# Altium schematic sheet Sheet1.SchDoc
size 431 x 279 mm; SheetNumber: 1; SheetTotal: 1; ENG_APP_DATE: --/--/--; DSN_APP_DATE: --/--/--; CHK_APP_DATE: --/--/--; SPICEModelCacheCJHNTGTK: <root> / <DocumentId>CJHNTGTK</DocumentId> / </root>
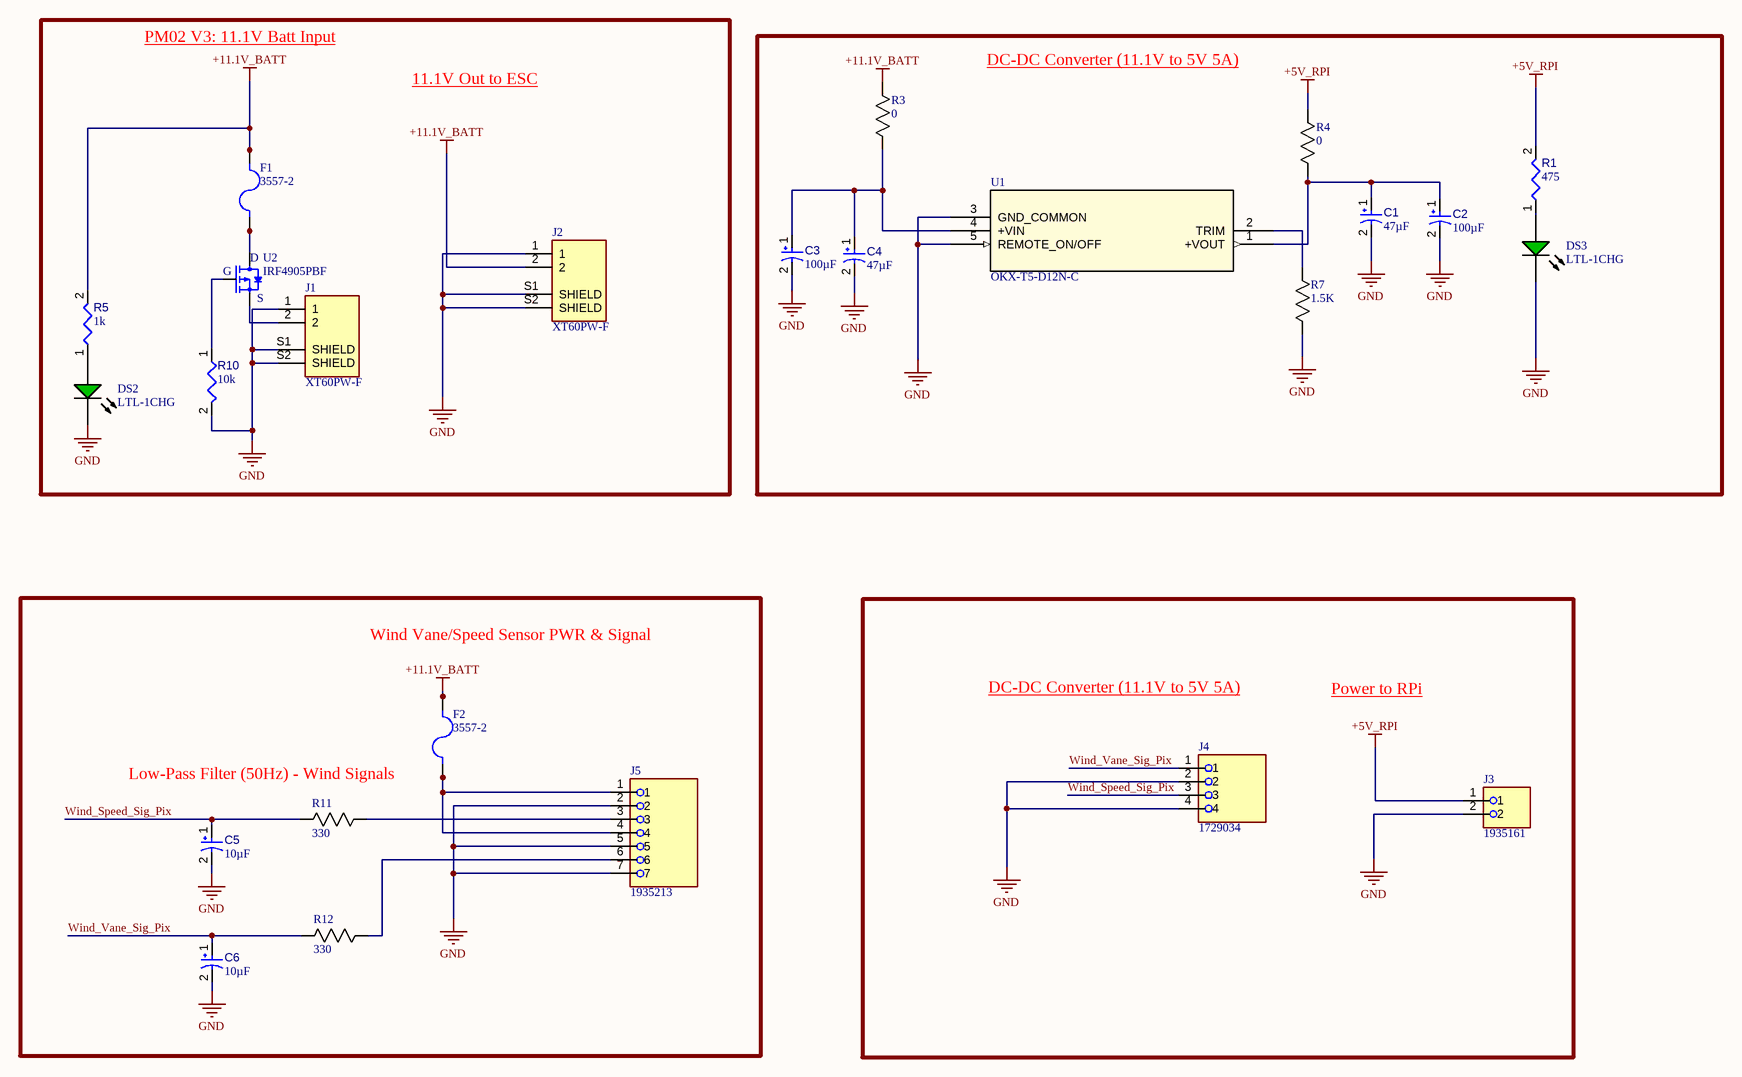
[diagram p0: Sheet1.SchDoc]

## Parts
C1  value 47µF  [CAPPR55-250-1120X630X1220]  (hidden comment: ECA-1HM470)
C2  value 100µF  [CAPPR65-350-1150X800X1250]  (hidden comment: ECA1HM101)
C3  value 100µF  [CAPPR65-350-1150X800X1250]  (hidden comment: ECA1HM101)
C4  value 47µF  [CAPPR55-250-1120X630X1220]  (hidden comment: ECA-1HM470)
C5  value 10µF  [CAPPR55-200-1100X500X1200]  (hidden comment: ECA1HM100)
C6  value 10µF  [CAPPR55-200-1100X500X1200]  (hidden comment: ECA1HM100)
DS2  LTL-1CHG  [LTST-LTL-1CHG-2]
DS3  LTL-1CHG  [LTST-LTL-1CHG-2]
F1  3557-2  [FUSE_3557-2]
F2  3557-2  [FUSE_3557-2]
J1  XT60PW-F  [AMASS_XT60PW-F]
J2  XT60PW-F  [AMASS_XT60PW-F]
J3  1935161  [PHOENIX_1935161]
J4  1729034  [PHOENIX_1729034]
J5  1935213  [PHOENIX_1935213]
R1  value 475  [RESA60-630X240]  (hidden comment: MFR-25FBF52-475R)
R3  value 0  [RES_ZOR25_6P3X2P3_YAG]  (hidden comment: RES 0 OHM JUMPER 1/4W AXIAL)
R4  value 0  [RES_ZOR25_6P3X2P3_YAG]  (hidden comment: RES 0 OHM JUMPER 1/4W AXIAL)
R5  value 1k  [RESA60-630X240]  (hidden comment: MFR-25FBF52-1K)
R7  1.5K  [STA_CF14_STP]
R10  value 10k  [RESA60-630X240]  (hidden comment: MFR-25FBF52-10K)
R11  value 330  [STA_CF14_STP]  (hidden comment: CF14JT330R)
R12  value 330  [STA_CF14_STP]  (hidden comment: CF14JT330R)
U1  OKX-T5-D12N-C  [OKX-T5-D12N-C_MUR]
U2  IRF4905PBF  [PG-TO220-3_INF]

## Blocks framed on the sheet
DC-DC Converter (11.1V to 5V 5A): C1-C4 DS3 R1 R3 R4 R7 U1

## Nets
+5V_RPI: J3.1 R1.2 R4.2
+11.1V_BATT: F1.2_1 F1.2_2 F2.2_1 F2.2_2 J2.2 R3.2 R5.2
GND: C1.2 C2.2 C3.2 C4.2 C5.2 C6.2 DS2.2(K) DS3.2(K) J1.1 J1.S1(SHIELD) J1.S2(SHIELD) J2.1 J2.S1(SHIELD) J2.S2(SHIELD) J3.2 J4.2 J4.4 J5.2 J5.5 J5.7 R7.1 R10.2 U1.3(GND_COMMON) U1.5(REMOTE_ON/OFF)
Wind_Speed_Sig_Pix: C5.1 J4.3 R11.1
Wind_Vane_Sig_Pix: C6.1 J4.1 R12.1
NetC1_1: C1.1 C2.1 R4.1 U1.1(+VOUT)
NetC3_1: C3.1 C4.1 R3.1 U1.4(+VIN)
NetDS2_1: DS2.1(A) R5.1
NetDS3_1: DS3.1(A) R1.1
NetF1_1_1: F1.1_1 F1.1_2 U2.2(D)
NetF2_1_1: F2.1_1 F2.1_2 J5.1 J5.4
NetJ1_2: J1.2 U2.3(S)
NetJ5_3: J5.3 R11.2
NetJ5_6: J5.6 R12.2
NetR7_2: R7.2 U1.2(TRIM)
NetR10_1: R10.1 U2.1(G)

## Notes on the sheet
- PM02 V3: 11.1V Batt Input <https://www.murata.com/products/productdata/8807038779422/okx-t5-d12.pdf>
- 11.1V Out to ESC <https://www.murata.com/products/productdata/8807038779422/okx-t5-d12.pdf>
- Wind Vane/Speed Sensor PWR & Signal
- DC-DC Converter (11.1V to 5V 5A) <https://www.murata.com/products/productdata/8807038779422/okx-t5-d12.pdf>
- Power to RPi <https://www.murata.com/products/productdata/8807038779422/okx-t5-d12.pdf>
- (near F2) Low-Pass Filter (50Hz) - Wind Signals
- DWG. NO.
- REV.
- SHT.
- THIS DOCUMENT AND THE DATA DISCLOSED HEREIN OR HEREWITH IS THE PROPERTY OF ALTIUM LIMITED AND MAY BE FREELY DISTRIBUTED IN WHOLE. NO RIGHTS ARE RESERVED OR EXPRESS OR IMPLIED WARANTEE GIVEN.
- REVISION
- DESCRIPTION
- DATE
- APPROVED
- ENG:
- APPROVALS
- PROJECT
- DSN:
- CHK:
- REFERENCE DOCUMENTS
- PROJECT REVISION:
- TITLE
- DOCUMENT REVISION:
- DESIGN ITEM:
- BOM:
- FAB DWG:
- PCB DWG:
- ASSY DWG:
- SCALE:
- SIZE
- B
- CAGE CODE
- FILE NAME
- DWG NO.
- SHEET
- OF
- REV

## Library data of the parts
C1 C4 = CMP-001-00031-7: Aluminum Electrolytic Capacitor, 47 uF, +/-20%, 50 V, -40 to 85 degC, 2-Pin THD, RoHS, Bulk; Manufacturer: Panasonic; Ripple Current: 130mA; Voltage Rating: 50V; Tolerance: 20%; RoHS Compliant: True; Lead Pitch: 2.5mm; Packaging: Bulk; Case/Package: Radial; Diameter: 6.3mm; Datasheet Version: Apr-16; Mounting Technology: TH; Max Operating Temperature: 85°C; Package Quantity: 200; Package Description: 2-Pin Radial Lead, Dia 6.3 mm, Height 12.2 mm; Capacitor Type: Electrolytic; Min Operating Temperature: -40°C; Ripple Current (AC): 130mA; Manufacturer URL: http://www.panasonic.com/; Pins: 2; Datasheet URL: https://industrial.panasonic.com/cdbs/www-data/pdf/RDF0000/DMF0000COL72.pdf; Package Reference: CAPPR55-250-1120X630X1220
C2 C3 = CMP-001-00026-7: Aluminum Electrolytic Capacitor, 100 uF, +/- 20%, 50 V, -40 to 85 degC, 2-Pin THD, RoHS, Bulk; Manufacturer: Panasonic; Voltage Rating: 50V; Ripple Current: 250mA; Datasheet URL: https://industrial.panasonic.com/cdbs/www-data/pdf/RDF0000/ABA0000C1218.pdf; Lead Pitch: 3.5mm; Mounting Technology: TH; Package Description: 2-Pin Radial Lead, Dia 8 mm, Height 12.5 mm; Diameter: 8mm; Ripple Current (AC): 250mA; Manufacturer URL: http://www.panasonic.com/; Capacitor Type: Electrolytic; Max Operating Temperature: 85°C; Pins: 2; Min Operating Temperature: -40°C; Tolerance: 20%; Case/Package: Radial; Packaging: Bulk; Package Quantity: 200; Package Reference: CAPPR65-350-1150X800X1250; RoHS Compliant: True; Datasheet Version: Rev. 05, 10/2016
C5 C6 = CMP-001-00025-7: Aluminum Electrolytic Capacitor, 10 uF, +/- 20%, 50 V, -40 to 85 degC, 2-Pin THD, RoHS, Bulk; Manufacturer: Panasonic; Ripple Current (AC): 65mA; Voltage Rating: 50V; Mounting Technology: TH; RoHS Compliant: True; Capacitor Type: Electrolytic; Datasheet Version: Rev. 05, 10/2016; Min Operating Temperature: -40°C; Packaging: Bulk; Ripple Current: 65mA; Tolerance: 20%; Max Operating Temperature: 85°C; Datasheet URL: https://industrial.panasonic.com/cdbs/www-data/pdf/RDF0000/ABA0000C1218.pdf; Lead Pitch: 2mm; Pins: 2; Diameter: 5mm; Manufacturer URL: http://www.panasonic.com/; Package Reference: CAPPR55-200-1100X500X1200; Package Description: 2-Pin Radial Lead, Dia 5 mm, Height 12 mm; Case/Package: Radial; Package Quantity: 200
DS2 DS3 = CMP-007-00019-2: LED Uni-Color Green, 100 mW, 30 mA, -55 to 100 degC, 2-Pin THD, RoHS, Bulk; Manufacturer: Lite-On; Power: 100mW; Forward Voltage: 2.6V; Forward Current: 30mA; Nominal Vf: 2.1V; Lens Style: Dome; Viewing Angle: 60degrees; Luminous Intensity: 12.6mcd; Max Operating Temperature: 100°C; Case/Package: Radial; Package Reference: LTL-1CHG; Manufacturer URL: http://www.us.liteon.com/; Package Quantity: 1000; Colour: Green; Packaging: Bulk; RoHS Compliant: True; Datasheet URL: http://datasheet.octopart.com/LTL-1CHG-Lite-On-datasheet-143841.pdf; Package Description: 2-Pin Through Hole Device, Dia 3.8 mm; Min Operating Temperature: -55°C; Mounting Technology: TH; Pins: 2; Illumination Colour: Green; Datasheet Version: Mar-00
F1 F2 = CMP-005-00015-1: THM 2 in 1 Auto Blade Holder; MF: Keystone Electronics; SnapEDA_Link: https://www.snapeda.com/parts/3557-2/Keystone+Electronics/view-part/?ref=snap; Pins: 4; Component Type: Standard; Source: 3557-2.SchLib; Purchase-URL: https://pricing.snapeda.com/search/part/3557-2/?ref=eda; Check_prices: https://www.snapeda.com/parts/3557-2/Keystone+Electronics/view-part/?ref=eda; Availability: In Stock; Value: *; Design Item ID: 3557-2; Case/Package: Nonstandard Keystone; MP: 3557-2; Price: None
J1 J2 = CMP-002-00071-1: Socket DC Supply Connector Female; MF: AMASS; Component Type: Standard; MP: XT60PW-F; Value: *; Case/Package: Package; SnapEDA_Link: https://www.snapeda.com/parts/XT60PW-F/AMASS/view-part/?ref=snap; Availability: Not in stock; Check_prices: https://www.snapeda.com/parts/XT60PW-F/AMASS/view-part/?ref=eda; Price: None; Pins: 4; Source: XT60PW-F.SchLib; Design Item ID: XT60PW-F
J3 = CMP-022-000001-1: PCB Terminal Screw 5mm 16AWG 400V 17.5A 2 Position COMBICON PT Series; MF: Phoenix Contact; Pin Count: 2; Value: *; Check_prices: https://www.snapeda.com/parts/1935161/Phoenix+Contact/view-part/?ref=eda; Design Item ID: 1935161; Source: 1935161.SchLib; MP: 1935161; Package: None; Component Type: Standard; SnapEDA_Link: https://www.snapeda.com/parts/1935161/Phoenix+Contact/view-part/?ref=snap
J4 = CMP-022-000005-1: PCB Terminal Screw 5mm 16AWG 400V 13.5A 4 Position COMBICON MKDSN Series; MF: Phoenix Contact; MP: 1729034; Source: 1729034.SchLib; Package: None; Check_prices: https://www.snapeda.com/parts/1729034/Phoenix+Contact/view-part/?ref=eda; SnapEDA_Link: https://www.snapeda.com/parts/1729034/Phoenix+Contact/view-part/?ref=snap; Pin Count: 4; Value: *; Component Type: Standard; Design Item ID: 1729034
J5 = CMP-022-000002-1: PCB Terminal Screw 5mm 16AWG 400V 17.5A 7 Position COMBICON PT Series; MF: Phoenix Contact; MP: 1935213; Check_prices: https://www.snapeda.com/parts/1935213/Phoenix+Contact/view-part/?ref=eda; SnapEDA_Link: https://www.snapeda.com/parts/1935213/Phoenix+Contact/view-part/?ref=snap; Source: 1935213.SchLib; Package: None; Design Item ID: 1935213; Pin Count: 7; Value: *; Component Type: Standard
R1 = CMP-009-00056-4: Axial Resistor, 475 Ohm, +/- 1%, 0.25 W, -55 to 155 degC, 2-Pin THD, RoHS, Bulk; Manufacturer: Yageo; Voltage Rating: 250V; Power: 250mW; Case/Package: Axial; Datasheet URL: http://www.yageo.com/documents/recent/Yageo%20LR_MFR_2013.pdf; Tolerance: 1%; RoHS Compliant: True; Mounting Technology: TH; Packaging: Bulk; Package Description: 2-Pin Axial Lead, Dia 2.4 mm, Body Length 6.3 mm; Max Operating Temperature: 155°C; Package Reference: MFR-25; Datasheet Version: Apr-13; Min Operating Temperature: -55°C; Package Quantity: 200; Manufacturer URL: http://www.yageo.com/
R3 R4 = CMP-009-00178-3: Mfr_Name: Yageo; Source: ZOR-25-R-52-0R.SchLib; Design Item ID: ZOR-25-R-52-0R
R5 = CMP-009-00048-4: Axial Resistor, 1 KOhm, +/- 1%, 250 mW, -55 to 155 degC, 2-Pin THD, RoHS, Bulk; Manufacturer: Yageo; Voltage Rating: 250V; Power: 250mW; Min Operating Temperature: -55°C; Max Operating Temperature: 155°C; Tolerance: 1%; Package Reference: MFR-25; Composition: CarbonFilm; Mounting Technology: TH; Packaging: Bulk; Case/Package: Axial; Datasheet URL: http://www.yageo.com/documents/recent/Yageo%20LR_MFR_2013.pdf; Package Quantity: 200; Manufacturer URL: http://www.yageo.com/; Package Description: 2-Pin Axial Lead, Dia 2.4 mm, Body Length 6.3 mm; Datasheet Version: Apr-13; RoHS Compliant: True
R7 = CMP-009-00177-2: RES 1.5K OHM 5% 1/4W AXIAL; Mfr_Name: Stackpole International; Mfr_Part_Number: CF14JT1K50; Design Item ID: CF14JT1K50; Source: CF14JT1K50.SchLib
R10 = CMP-009-00047-4: Axial Resistor, 10 KOhm, +/- 1%, 0.25 W, -55 to 155 degC, 2-Pin THD, RoHS, Bulk; Manufacturer: Yageo; Power: 250mW; Voltage Rating: 250V; Manufacturer URL: http://www.yageo.com/; Datasheet URL: http://www.yageo.com/documents/recent/Yageo%20LR_MFR_2013.pdf; Package Reference: MFR-25; Min Operating Temperature: -55°C; Mounting Technology: TH; Package Quantity: 200; Case/Package: Axial; Tolerance: 1%; RoHS Compliant: True; Datasheet Version: Apr-13; Packaging: Bulk; Max Operating Temperature: 155°C; Package Description: 2-Pin Axial Lead, Dia 2.4 mm, Body Length 6.3 mm
R11 R12 = CMP-009-00179-2: RES 330 OHM 5% 1/4W AXIAL; Mfr_Name: Stackpole International; Source: CF14JT330R.SchLib; Design Item ID: CF14JT330R
U1 = CMP-004-000001-1: No Description Available; Mfr_Name: Murata; Source: OKX-T5-D12N-C.SchLib; Type: Type; Design Item ID: OKX-T5-D12N-C; RefDes: RefDes
U2 = CMP-039-000000-2: No Description Available; Mfr_Name: Infineon; Source: IRF4905PBF.SchLib; Design Item ID: IRF4905PBF; RefDes: RefDes; Type: Type